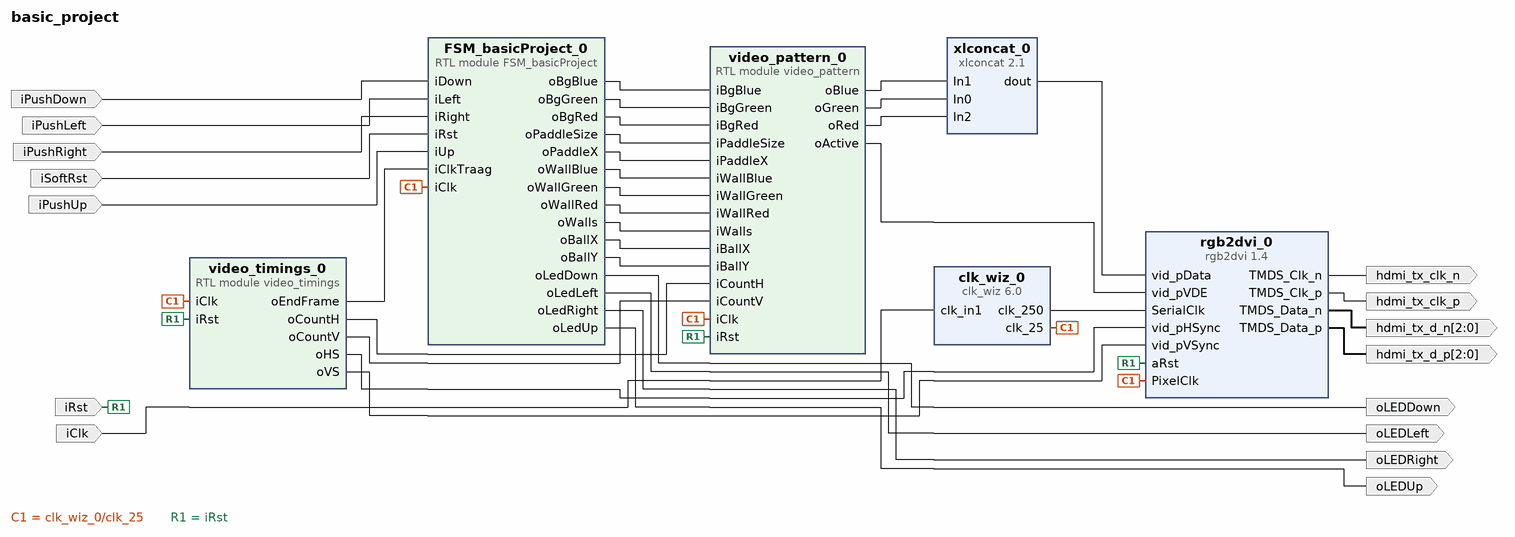
[diagram p0: block diagram of the top level]
# Vivado block design basic_project, xc7z020clg400-1, Vivado 2025.1
create_bd_design basic_project

create_bd_port -dir I iRst
create_bd_port -dir I -type clk iClk
create_bd_port -dir O -type clk hdmi_tx_clk_p
create_bd_port -dir O -type clk hdmi_tx_clk_n
create_bd_port -dir O -from 2 -to 0 hdmi_tx_d_p
create_bd_port -dir O -from 2 -to 0 hdmi_tx_d_n
create_bd_port -dir I iPushDown
create_bd_port -dir I iPushUp
create_bd_port -dir I iPushLeft
create_bd_port -dir I iPushRight
create_bd_port -dir O oLEDRight
create_bd_port -dir O oLEDLeft
create_bd_port -dir O oLEDUp
create_bd_port -dir O oLEDDown
create_bd_port -dir I iSoftRst

create_bd_cell -type module -reference video_timings video_timings_0
create_bd_cell -type module -reference video_pattern video_pattern_0
create_bd_cell -type ip -vlnv digilentinc.com:ip:rgb2dvi:1.4 rgb2dvi_0
set_property -dict {CONFIG.kGenerateSerialClk false} [get_bd_cells rgb2dvi_0]
create_bd_cell -type ip -vlnv xilinx.com:ip:xlconcat:2.1 xlconcat_0
set_property -dict {CONFIG.IN0_WIDTH 8 CONFIG.IN1_WIDTH 8 CONFIG.IN2_WIDTH 8 CONFIG.NUM_PORTS 3} [get_bd_cells xlconcat_0]
create_bd_cell -type ip -vlnv xilinx.com:ip:clk_wiz:6.0 clk_wiz_0
set_property -dict [list \
  CONFIG.CLKIN1_JITTER_PS 80.0 \
  CONFIG.CLKOUT1_JITTER 165.419 \
  CONFIG.CLKOUT1_PHASE_ERROR 96.948 \
  CONFIG.CLKOUT1_REQUESTED_OUT_FREQ 25 \
  CONFIG.CLKOUT2_JITTER 104.759 \
  CONFIG.CLKOUT2_PHASE_ERROR 96.948 \
  CONFIG.CLKOUT2_REQUESTED_OUT_FREQ 250 \
  CONFIG.CLKOUT2_USED true \
  CONFIG.CLK_IN1_BOARD_INTERFACE sys_clock \
  CONFIG.CLK_OUT1_PORT clk_25 \
  CONFIG.CLK_OUT2_PORT clk_250 \
  CONFIG.MMCM_CLKFBOUT_MULT_F 8.000 \
  CONFIG.MMCM_CLKIN1_PERIOD 8.000 \
  CONFIG.MMCM_CLKOUT0_DIVIDE_F 40.000 \
  CONFIG.MMCM_CLKOUT1_DIVIDE 4 \
  CONFIG.NUM_OUT_CLKS 2 \
  CONFIG.USE_LOCKED false \
  CONFIG.USE_RESET false \
] [get_bd_cells clk_wiz_0]
create_bd_cell -type module -reference FSM_basicProject FSM_basicProject_0

# ---- connections ----

connect_bd_net [get_bd_pins FSM_basicProject_0/oBgBlue] [get_bd_pins video_pattern_0/iBgBlue]
connect_bd_net [get_bd_pins FSM_basicProject_0/oBgGreen] [get_bd_pins video_pattern_0/iBgGreen]
connect_bd_net [get_bd_pins FSM_basicProject_0/oBgRed] [get_bd_pins video_pattern_0/iBgRed]
connect_bd_net [get_bd_pins FSM_basicProject_0/oLedDown] [get_bd_ports oLEDDown]
connect_bd_net [get_bd_pins FSM_basicProject_0/oLedLeft] [get_bd_ports oLEDLeft]
connect_bd_net [get_bd_pins FSM_basicProject_0/oLedRight] [get_bd_ports oLEDRight]
connect_bd_net [get_bd_pins FSM_basicProject_0/oLedUp] [get_bd_ports oLEDUp]
connect_bd_net [get_bd_pins FSM_basicProject_0/oPaddleSize] [get_bd_pins video_pattern_0/iPaddleSize]
connect_bd_net -net FSM_basicProject_0_oShapSize [get_bd_pins FSM_basicProject_0/oPaddleX] [get_bd_pins video_pattern_0/iPaddleX]
connect_bd_net [get_bd_pins FSM_basicProject_0/oWallBlue] [get_bd_pins video_pattern_0/iWallBlue]
connect_bd_net [get_bd_pins FSM_basicProject_0/oWallGreen] [get_bd_pins video_pattern_0/iWallGreen]
connect_bd_net [get_bd_pins FSM_basicProject_0/oWallRed] [get_bd_pins video_pattern_0/iWallRed]
connect_bd_net [get_bd_pins FSM_basicProject_0/oWalls] [get_bd_pins video_pattern_0/iWalls]
connect_bd_net -net FSM_basicProject_0_oXball [get_bd_pins FSM_basicProject_0/oBallX] [get_bd_pins video_pattern_0/iBallX]
connect_bd_net -net FSM_basicProject_0_oYBall [get_bd_pins FSM_basicProject_0/oBallY] [get_bd_pins video_pattern_0/iBallY]
connect_bd_net [get_bd_pins clk_wiz_0/clk_25] \
  [get_bd_pins rgb2dvi_0/PixelClk] [get_bd_pins FSM_basicProject_0/iClk] [get_bd_pins video_pattern_0/iClk] \
  [get_bd_pins video_timings_0/iClk]
connect_bd_net [get_bd_pins clk_wiz_0/clk_250] [get_bd_pins rgb2dvi_0/SerialClk]
connect_bd_net [get_bd_ports iClk] [get_bd_pins clk_wiz_0/clk_in1]
connect_bd_net -net iDown_0_1 [get_bd_ports iPushDown] [get_bd_pins FSM_basicProject_0/iDown]
connect_bd_net -net iLeft_0_1 [get_bd_ports iPushLeft] [get_bd_pins FSM_basicProject_0/iLeft]
connect_bd_net -net iRight_0_1 [get_bd_ports iPushRight] [get_bd_pins FSM_basicProject_0/iRight]
connect_bd_net -net iRst_0_1 [get_bd_ports iRst] [get_bd_pins rgb2dvi_0/aRst] [get_bd_pins video_pattern_0/iRst] [get_bd_pins video_timings_0/iRst]
connect_bd_net -net iRst_0_2 [get_bd_ports iSoftRst] [get_bd_pins FSM_basicProject_0/iRst]
connect_bd_net -net iUp_0_1 [get_bd_ports iPushUp] [get_bd_pins FSM_basicProject_0/iUp]
connect_bd_net [get_bd_pins rgb2dvi_0/TMDS_Clk_n] [get_bd_ports hdmi_tx_clk_n]
connect_bd_net [get_bd_pins rgb2dvi_0/TMDS_Clk_p] [get_bd_ports hdmi_tx_clk_p]
connect_bd_net [get_bd_pins rgb2dvi_0/TMDS_Data_n] [get_bd_ports hdmi_tx_d_n]
connect_bd_net [get_bd_pins rgb2dvi_0/TMDS_Data_p] [get_bd_ports hdmi_tx_d_p]
connect_bd_net [get_bd_pins video_pattern_0/oActive] [get_bd_pins rgb2dvi_0/vid_pVDE]
connect_bd_net [get_bd_pins video_pattern_0/oBlue] [get_bd_pins xlconcat_0/In1]
connect_bd_net [get_bd_pins video_pattern_0/oGreen] [get_bd_pins xlconcat_0/In0]
connect_bd_net [get_bd_pins video_pattern_0/oRed] [get_bd_pins xlconcat_0/In2]
connect_bd_net [get_bd_pins video_timings_0/oCountH] [get_bd_pins video_pattern_0/iCountH]
connect_bd_net [get_bd_pins video_timings_0/oCountV] [get_bd_pins video_pattern_0/iCountV]
connect_bd_net [get_bd_pins video_timings_0/oEndFrame] [get_bd_pins FSM_basicProject_0/iClkTraag]
connect_bd_net [get_bd_pins video_timings_0/oHS] [get_bd_pins rgb2dvi_0/vid_pHSync]
connect_bd_net [get_bd_pins video_timings_0/oVS] [get_bd_pins rgb2dvi_0/vid_pVSync]
connect_bd_net [get_bd_pins xlconcat_0/dout] [get_bd_pins rgb2dvi_0/vid_pData]

validate_bd_design
save_bd_design
